# Altium project 2_Smoke_detector.PrjPcb (part 3 of 6)
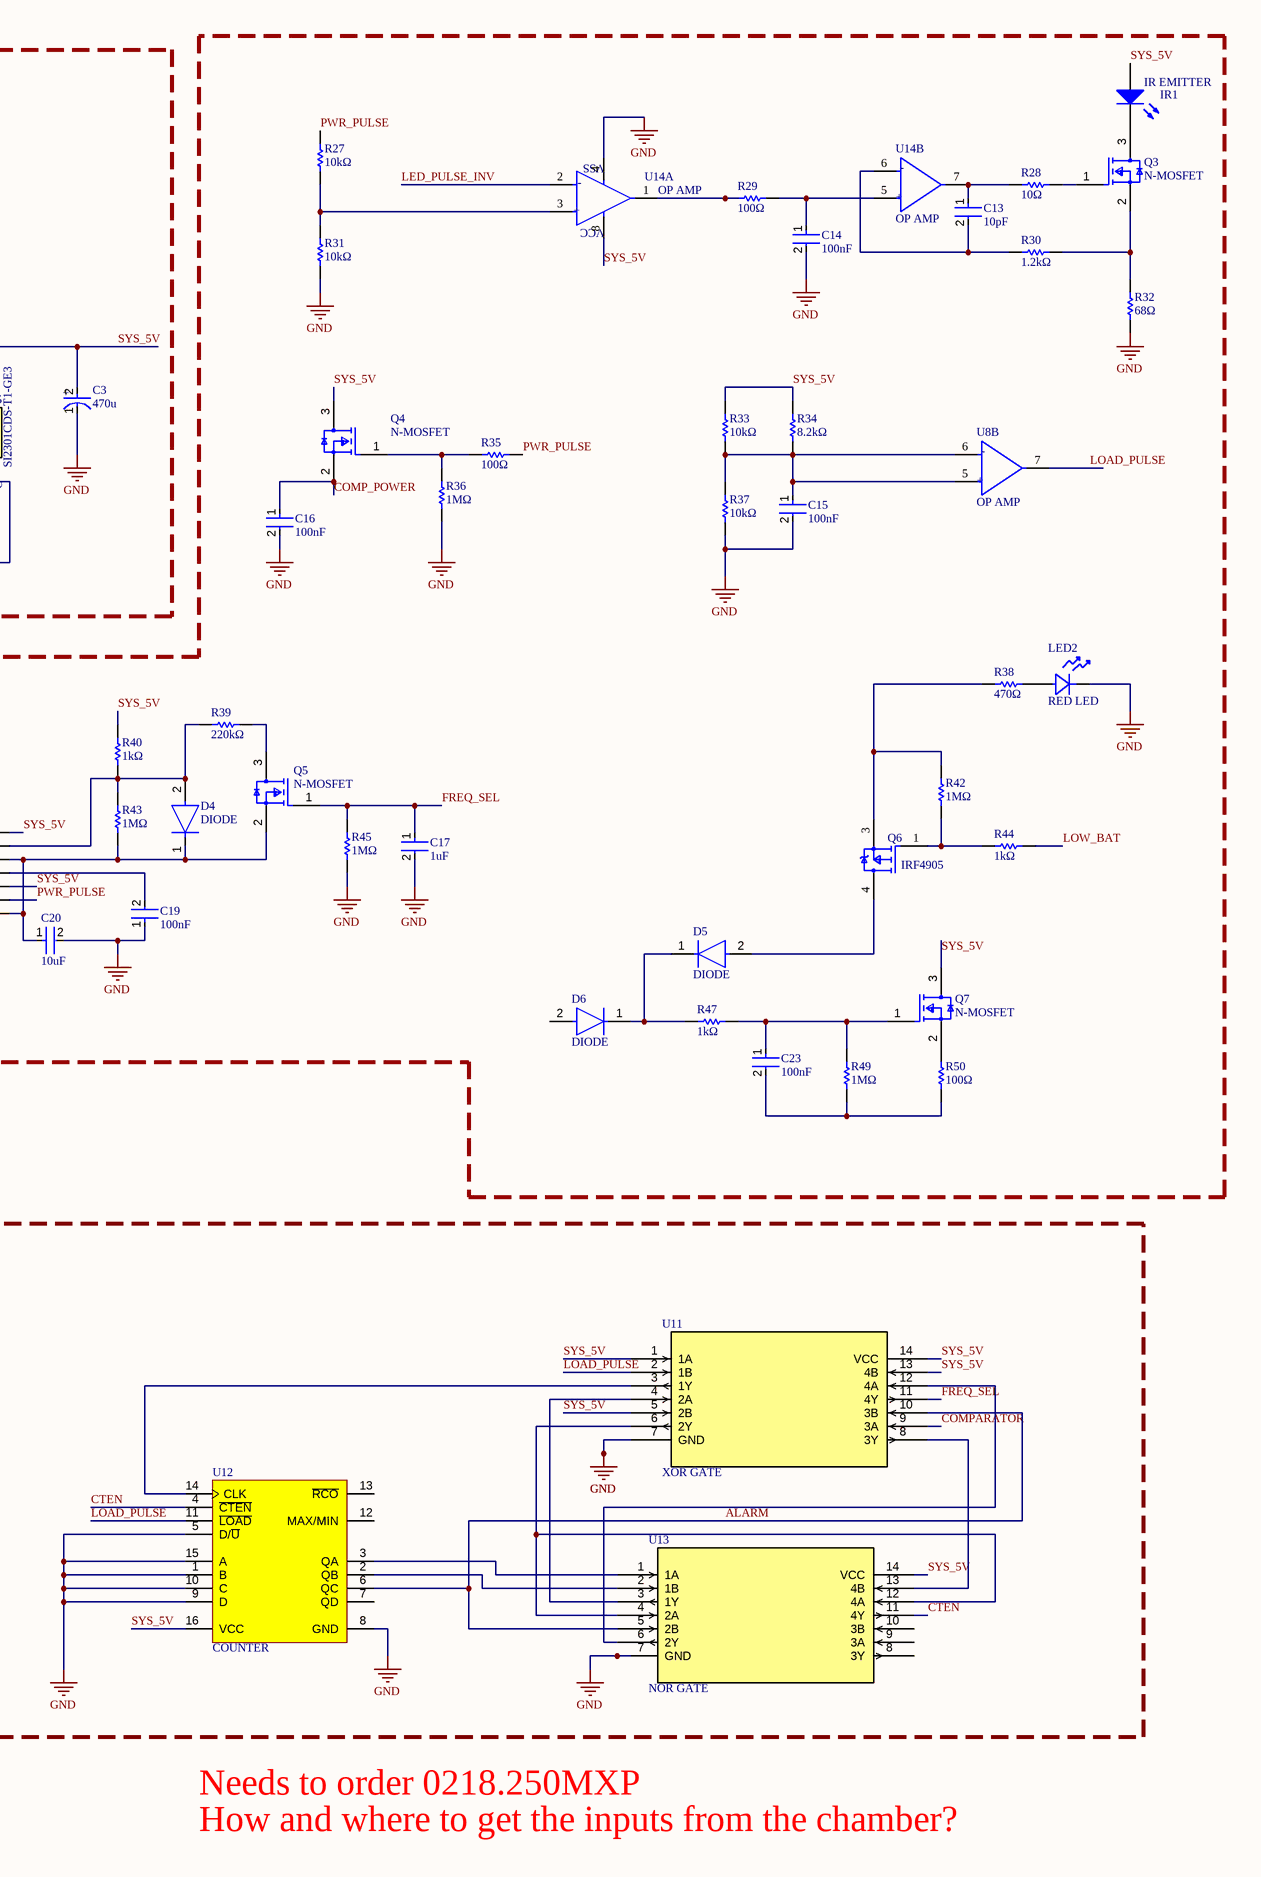
[diagram p3: 2_Smoke_detector.SchDoc, right]

## Sheet 2_Smoke_detector.SchDoc (continued)

### Library data of the parts (continued)
C17 = CL21B105KBFNNNE: CAP CER 1uF 50V X7R 0805; Manufacturer: Samsung Electro-Mechanics; Value: 1µF; Dielectric Material: Ceramic; Tolerance: 10%; Supplier: Avnet; Supplier Part Number: CL21B105KBFNNNE; Manufacturer Part Number: CL21B105KBFNNNE; RoHS: Compliant; Category: Ceramic Capacitors; Pricing: 2000=0.01628 (USD); Case/Package: 0805; Case Code (Imperial): 0805; Case Code (Metric): 2012; China RoHS: Compliant; Country of Origin: Mainland China, Philippines, South Korea; Depth: 1.25mm; Dielectric: X7R; Export Control Classification Number (ECCN) Code: EAR99; Height: 1.35mm; Harmonized Tariff Schedule (HTS) Code: 8532.24.00.20; Introduction Date: 2010-07-30; Length: 2mm; Lifecycle Status: Production; Material: Ceramic; Max Operating Temperature: 125°C; Min Operating Temperature: -55°C; Mounting Technology: Surface Mount; Number of Terminals: 2; Radiation Hardening: No; REACH SVHC: Unaffected; Schedule B: 8532240020, 8532240020|8532240020, 8532240020|8532240020|8532240020, 8532240020|8532240020|8532240020|8532240020; Thickness: 1.3462mm; Voltage: 50V; Voltage Rating: 50V; Voltage Rating (DC): 50V; Width: 1.25mm; ComponentLink1URL: https://datasheet.octopart.com:443/CL21B105KBFNNNE-Samsung-Electro-Mechanics-datasheet-136482495.pdf?src-supplier=IHS; ComponentLink1Description: https://datasheet.octopart.com:443/CL21B105KBFNNNE-Samsung-Electro-Mechanics-datasheet-136482495.pdf?src-supplier=IHS; ComponentLink2URL: https://datasheet.octopart.com:443/CL21B105KBFNNNE-Samsung-Electro-Mechanics-datasheet-11733377.pdf?src-supplier=Future+Electronics; ComponentLink2Description: https://datasheet.octopart.com:443/CL21B105KBFNNNE-Samsung-Electro-Mechanics-datasheet-11733377.pdf?src-supplier=Future+Electronics; ComponentLink3URL: https://datasheet.octopart.com:443/CL21B105KBFNNNE-Samsung-Electro-Mechanics-datasheet-116891038.pdf?src-supplier=Future+Electronics; ComponentLink3Description: https://datasheet.octopart.com:443/CL21B105KBFNNNE-Samsung-Electro-Mechanics-datasheet-116891038.pdf?src-supplier=Future+Electronics; ComponentLink4URL: https://datasheet.octopart.com:443/CL21B105KBFNNNE-Samsung-Electro-Mechanics-datasheet-81462183.pdf?src-supplier=Future+Electronics; ComponentLink4Description: https://datasheet.octopart.com:443/CL21B105KBFNNNE-Samsung-Electro-Mechanics-datasheet-81462183.pdf?src-supplier=Future+Electronics; ComponentLink5URL: https://datasheet.octopart.com:443/CL21B105KBFNNNE-Samsung-datasheet-48647582.pdf?src-supplier=Future+Electronics; ComponentLink5Description: https://datasheet.octopart.com:443/CL21B105KBFNNNE-Samsung-datasheet-48647582.pdf?src-supplier=Future+Electronics; ComponentLink6URL: https://datasheet.octopart.com:443/CL21B105KBFNNNE-Samsung-datasheet-8326294.pdf?src-supplier=Future+Electronics; ComponentLink6Description: https://datasheet.octopart.com:443/CL21B105KBFNNNE-Samsung-datasheet-8326294.pdf?src-supplier=Future+Electronics; ComponentLink7URL: https://datasheet.octopart.com:443/CL21B105KBFNNNE-Samsung-Electro-Mechanics-datasheet-149045959.pdf?src-supplier=Future+Electronics; ComponentLink7Description: https://datasheet.octopart.com:443/CL21B105KBFNNNE-Samsung-Electro-Mechanics-datasheet-149045959.pdf?src-supplier=Future+Electronics; ComponentLink8URL: https://datasheet.octopart.com/CL21B105KBFNNNE-Samsung-Electro-Mechanics-datasheet-97040617.pdf; ComponentLink8Description: https://datasheet.octopart.com/CL21B105KBFNNNE-Samsung-Electro-Mechanics-datasheet-97040617.pdf; ComponentLink9URL: https://datasheet.octopart.com/CL21B105KBFNNNE-Samsung-Electro-Mechanics-datasheet-8324245.pdf; ComponentLink9Description: https://datasheet.octopart.com/CL21B105KBFNNNE-Samsung-Electro-Mechanics-datasheet-8324245.pdf; ComponentLink10URL: https://datasheet.octopart.com/General-Multilayer-Ceramic-Capacitors-Samsung-datasheet-family-111.pdf; ComponentLink10Description: https://datasheet.octopart.com/General-Multilayer-Ceramic-Capacitors-Samsung-datasheet-family-111.pdf; ComponentLink11URL: https://datasheet.octopart.com:443/CL21B105KBFNNNE-Samsung-datasheet-59220082.pdf?src-supplier=TME; ComponentLink11Description: https://datasheet.octopart.com:443/CL21B105KBFNNNE-Samsung-datasheet-59220082.pdf?src-supplier=TME; ComponentLink12URL: http://sigma.octopart.com:80/rohs_certificate/General-Multilayer-Ceramic-Capacitors-Samsung-family-110.pdf?src-supplier=Compliance+Statements; ComponentLink12Description: http://sigma.octopart.com:80/rohs_certificate/General-Multilayer-Ceramic-Capacitors-Samsung-family-110.pdf?src-supplier=Compliance+Statements; ComponentLink13URL: http://sigma.octopart.com:80/rohs_statement/General-Multilayer-Ceramic-Capacitors-Samsung-family-132.pdf?src-supplier=Compliance+Statements; ComponentLink13Description: http://sigma.octopart.com:80/rohs_statement/General-Multilayer-Ceramic-Capacitors-Samsung-family-132.pdf?src-supplier=Compliance+Statements; ComponentLink14URL: http://sigma.octopart.com:80/reach_statement/General-Multilayer-Ceramic-Capacitors-Samsung-family-133.pdf?src-supplier=Compliance+Statements; ComponentLink14Description: http://sigma.octopart.com:80/reach_statement/General-Multilayer-Ceramic-Capacitors-Samsung-family-133.pdf?src-supplier=Compliance+Statements; LCSC Part Number: C28323
C20 = TMK212BBJ106KG-T: CAP CER 10uF 25V X5R 0805; Manufacturer: TAIYO YUDEN; Manufacturer Package Identifier: 0805 (2012 metric); Value: 10µF; Dielectric Material: Ceramic; Tolerance: 10%; Voltage: 16V; Supplier: Future Electronics; Supplier Part Number: TMK212BBJ106KG-T; Manufacturer Part Number: TMK212BBJ106KG-T; RoHS: Compliant; Category: Ceramic Capacitors; Stock: 405000; Pricing: 3000=0.158, 6000=0.156, 9000=0.154, 12000=0.153 (USD); Case/Package: 0805; Case Code (Imperial): 0805; Case Code (Metric): 2012; Composition: Ceramic; Country of Origin: Japan, Mainland China, Malaysia, South Korea; Dielectric: X5R; Export Control Classification Number (ECCN) Code: EAR99; Height: 1.25mm; Harmonized Tariff Schedule (HTS) Code: 8532.24.00.20; Introduction Date: 2012-09-27; Lead Free: Lead Free; Length: 2mm; Lifecycle Status: Production; Material: Ceramic; Max Operating Temperature: 85°C; Min Operating Temperature: -55°C; Mounting Technology: Surface Mount; Pins: 2; Number of Terminals: 2; REACH SVHC: Unaffected; Termination: SMD/SMT; Thickness: 1.3462mm; Voltage Rating: 25V; Voltage Rating (DC): 25V; Width: 1.25mm; ComponentLink1URL: https://datasheet.octopart.com:443/TMK212BBJ106KG-T-Taiyo-Yuden-datasheet-182120866.pdf?src-supplier=IHS; ComponentLink1Description: https://datasheet.octopart.com:443/TMK212BBJ106KG-T-Taiyo-Yuden-datasheet-182120866.pdf?src-supplier=IHS; ComponentLink2URL: https://datasheet.octopart.com:443/TMK212BBJ106KG-T-Taiyo-Yuden-datasheet-181961944.pdf?src-supplier=Newark; ComponentLink2Description: https://datasheet.octopart.com:443/TMK212BBJ106KG-T-Taiyo-Yuden-datasheet-181961944.pdf?src-supplier=Newark; ComponentLink3URL: https://datasheet.octopart.com:443/TMK212BBJ106KG-T-Taiyo-Yuden-datasheet-23715841.pdf?src-supplier=Newark; ComponentLink3Description: https://datasheet.octopart.com:443/TMK212BBJ106KG-T-Taiyo-Yuden-datasheet-23715841.pdf?src-supplier=Newark; ComponentLink4URL: https://datasheet.octopart.com:443/TMK212BBJ106KG-T-Taiyo-Yuden-datasheet-10851928.pdf?src-supplier=element14+APAC; ComponentLink4Description: https://datasheet.octopart.com:443/TMK212BBJ106KG-T-Taiyo-Yuden-datasheet-10851928.pdf?src-supplier=element14+APAC; ComponentLink5URL: https://datasheet.octopart.com:443/TMK212BBJ106KG-T-Taiyo-Yuden-datasheet-154810078.pdf?src-supplier=Master+Electronics; ComponentLink5Description: https://datasheet.octopart.com:443/TMK212BBJ106KG-T-Taiyo-Yuden-datasheet-154810078.pdf?src-supplier=Master+Electronics; ComponentLink6URL: https://datasheet.octopart.com:443/TMK212BBJ106KG-T-Taiyo-Yuden-datasheet-10742123.pdf?src-supplier=Future+Electronics; ComponentLink6Description: https://datasheet.octopart.com:443/TMK212BBJ106KG-T-Taiyo-Yuden-datasheet-10742123.pdf?src-supplier=Future+Electronics; ComponentLink7URL: https://datasheet.octopart.com:443/TMK212BBJ106KG-T-Taiyo-Yuden-datasheet-99833418.pdf?src-supplier=Future+Electronics; ComponentLink7Description: https://datasheet.octopart.com:443/TMK212BBJ106KG-T-Taiyo-Yuden-datasheet-99833418.pdf?src-supplier=Future+Electronics; ComponentLink8URL: https://datasheet.octopart.com:443/TMK212BBJ106KG-T-Taiyo-Yuden-datasheet-138738940.pdf?src-supplier=Taiyo+Yuden+SCT; ComponentLink8Description: https://datasheet.octopart.com:443/TMK212BBJ106KG-T-Taiyo-Yuden-datasheet-138738940.pdf?src-supplier=Taiyo+Yuden+SCT; ComponentLink9URL: https://datasheet.octopart.com:443/TMK212BBJ106KG-T-Taiyo-Yuden-datasheet-27089299.pdf?src-supplier=Electro+Sonic; ComponentLink9Description: https://datasheet.octopart.com:443/TMK212BBJ106KG-T-Taiyo-Yuden-datasheet-27089299.pdf?src-supplier=Electro+Sonic
D1 = BZX84-C3V3,215: DIODE ZENER 3.3V 250MW TO236AB; Manufacturer: Nexperia; Manufacturer Lifecycle Status: RELEASED FOR SUPPLY; Element Configuration: Single; ESD Protection: No; Forward Current: 200mA; Forward Voltage: 900mV; Impedance: 95Ω; Max Junction Temperature (Tj): 150°C; Max Reverse Leakage Current: 5µA; Number of Elements: 1; Polarity: Unidirectional; Reverse Standoff Voltage: 1V; Test Current: 5mA; Tolerance: 5%; Supplier: Future Electronics; Supplier Part Number: BZX84-C3V3,215; Manufacturer Part Number: BZX84-C3V3,215; RoHS: Compliant; Category: Zener Diodes; Stock: 108000; Pricing: 3000=0.0267, 9000=0.0261, 30000=0.0254, 60000=0.025, 120000=0.0243 (USD); Ambient Temperature Range High: 150°C; Case/Package: SOT-23; China RoHS: Compliant; Composition: Zener; Contact Plating: Tin; Country of Origin: Mainland China; Export Control Classification Number (ECCN) Code: EAR99; Height: 1.1mm; Harmonized Tariff Schedule (HTS) Code: 8541.10.00.50; Introduction Date: 1999-05-18; Lead Free: Lead Free; Length: 3mm; Lifecycle Status: Production; Max Operating Temperature: 150°C; Max Power Dissipation: 250mW; Min Operating Temperature: -65°C; Mounting Technology: Surface Mount; Pins: 3; Number of Terminals: 3; Peak Reverse Current: 5µA; Power Dissipation: 250mW; Radiation Hardening: No; REACH SVHC: Unaffected; Reference Voltage: 3.3V; Reverse Voltage: 1V; Schedule B: 8541100050, 8541100050|8541100050|8541100050|8541100050|8541100050|8541100050|8541100050|8541100050|8541100050|8541100050|8541100050|8541100050|8541100050|8541100050|8541100050|8541100050|8541100050|8541100050|8541100050|8541100050|8541100050|8541100050|8541100050|85; Voltage Tolerance: 5%; Weight: 4.535924g; Width: 1.4mm; Working Voltage: 3.3V; Zener Current: 5mA; Zener Voltage: 3.3V; ComponentLink1URL: https://datasheet.octopart.com:443/BZX84-C3V3%2C215-Nexperia-datasheet-180923215.pdf?src-supplier=IHS; ComponentLink1Description: https://datasheet.octopart.com:443/BZX84-C3V3%2C215-Nexperia-datasheet-180923215.pdf?src-supplier=IHS; ComponentLink2URL: https://datasheet.octopart.com:443/BZX84-C3V3%2C215-Nexperia-datasheet-24570111.pdf?src-supplier=IHS; ComponentLink2Description: https://datasheet.octopart.com:443/BZX84-C3V3%2C215-Nexperia-datasheet-24570111.pdf?src-supplier=IHS; ComponentLink3URL: https://datasheet.octopart.com:443/BZX84-C3V3%2C215-Nexperia-datasheet-81885907.pdf?src-supplier=Newark; ComponentLink3Description: https://datasheet.octopart.com:443/BZX84-C3V3%2C215-Nexperia-datasheet-81885907.pdf?src-supplier=Newark; ComponentLink4URL: https://sigma.octopart.com:443/138797052/technical_drawing/Nexperia-BZX84-C3V3%2C215.pdf?src-supplier=Upverter; ComponentLink4Description: https://sigma.octopart.com:443/138797052/technical_drawing/Nexperia-BZX84-C3V3%2C215.pdf?src-supplier=Upverter; ComponentLink5URL: https://datasheet.octopart.com:443/BZX84-C3V3%2C215-NXP-Semiconductors-datasheet-8361847.pdf?src-supplier=TME; ComponentLink5Description: https://datasheet.octopart.com:443/BZX84-C3V3%2C215-NXP-Semiconductors-datasheet-8361847.pdf?src-supplier=TME; ComponentLink6URL: https://datasheet.octopart.com:443/BZX84-C3V3%2C215-Nexperia-datasheet-14490340.pdf?src-supplier=element14+APAC; ComponentLink6Description: https://datasheet.octopart.com:443/BZX84-C3V3%2C215-Nexperia-datasheet-14490340.pdf?src-supplier=element14+APAC; ComponentLink7URL: https://datasheet.octopart.com:443/BZX84-C3V3%2C215-Nexperia-datasheet-116120567.pdf?src-supplier=Farnell; ComponentLink7Description: https://datasheet.octopart.com:443/BZX84-C3V3%2C215-Nexperia-datasheet-116120567.pdf?src-supplier=Farnell; ComponentLink8URL: https://datasheet.octopart.com:443/BZX84-C3V3%2C215-Nexperia-datasheet-164870381.pdf?src-supplier=Burklin+Elektronik; ComponentLink8Description: https://datasheet.octopart.com:443/BZX84-C3V3%2C215-Nexperia-datasheet-164870381.pdf?src-supplier=Burklin+Elektronik; ComponentLink9URL: https://datasheet.octopart.com:443/BZX84-C3V3%2C215-NXP-Semiconductors-datasheet-7823842.pdf?src-supplier=Jameco+(USA); ComponentLink9Description: https://datasheet.octopart.com:443/BZX84-C3V3%2C215-NXP-Semiconductors-datasheet-7823842.pdf?src-supplier=Jameco+(USA); ComponentLink10URL: https://datasheet.octopart.com:443/BZX84-C3V3%2C215-NXP-datasheet-30538.pdf?src-supplier=Future+Electronics; ComponentLink10Description: https://datasheet.octopart.com:443/BZX84-C3V3%2C215-NXP-datasheet-30538.pdf?src-supplier=Future+Electronics; ComponentLink11URL: http://sigma.octopart.com:80/reach_statement/NXP-Semiconductors-company-13.pdf?src-supplier=Compliance+Statements; ComponentLink11Description: http://sigma.octopart.com:80/reach_statement/NXP-Semiconductors-company-13.pdf?src-supplier=Compliance+Statements; ComponentLink12URL: http://sigma.octopart.com:80/rohs_statement/NXP-Semiconductors-company-12.pdf?src-supplier=Compliance+Statements; ComponentLink12Description: http://sigma.octopart.com:80/rohs_statement/NXP-Semiconductors-company-12.pdf?src-supplier=Compliance+Statements; LCSC Part Number: C85087
D2-D6 = 1N4148WS-E3-08: DIODE STANDARD 75V 150MA SOD323F; Manufacturer: onsemi; Manufacturer Lifecycle Status: ACTIVE; Value: 4pF; Element Configuration: Single; Forward Voltage: 1V; Max Forward Surge Current (Ifsm): 4A; Max Junction Temperature (Tj): 150°C; Max Power Dissipation: 200mW; Number of Elements: 1; Peak Reverse Current: 5µA; Recovery Time: 4ns; Supplier: Future Electronics; Supplier Part Number: 1N4148WS; Manufacturer Part Number: 1N4148WS; RoHS: Compliant; Category: Rectifier Diodes; Stock: 2079000; Pricing: 3000=0.0259, 9000=0.0253, 30000=0.0247, 60000=0.0243, 120000=0.0236 (USD); Average Rectified Current: 150mA; China RoHS: Compliant; Contact Plating: Tin; Export Control Classification Number (ECCN) Code: EAR99; Forward Current: 150mA; Height: 900µm; Harmonized Tariff Schedule (HTS) Code: 8541.10.00.70; Introduction Date: 2008-03-28; Lead Free: Lead Free; Length: 1.8mm; Lifecycle Status: Production; Max Operating Temperature: 150°C; Max Output current: 150mA; Max Repetitive Reverse Voltage (Vrrm): 75V; Max Reverse Voltage (DC): 75V; Min Breakdown Voltage: 75V; Min Operating Temperature: -55°C; Mounting Technology: Surface Mount; Pins: 2; Number of Terminals: 2; Packaging: Cut Tape; Power Dissipation: 200mW; Radiation Hardening: No; REACH SVHC: Unaffected; Reverse Recovery Time: 4ns; Reverse Standoff Voltage: 75V; Reverse Voltage: 75V; Schedule B: 8541100070, 8541100070|8541100070|8541100070|8541100070|8541100070|8541100070|8541100070|8541100070|8541100070|8541100070|8541100070|8541100070|8541100070|8541100070|8541100070|8541100070|8541100070|8541100070|8541100070|8541100070|8541100070|8541100070|8541100070|85; Weight: 27.6mg; Width: 1.35mm; ComponentLink1URL: https://datasheet.octopart.com:443/1N4148WS-ON-Semiconductor-datasheet-154551630.pdf?src-supplier=Farnell; ComponentLink1Description: https://datasheet.octopart.com:443/1N4148WS-ON-Semiconductor-datasheet-154551630.pdf?src-supplier=Farnell; ComponentLink2URL: https://datasheet.octopart.com:443/1N4148WS-Fairchild-Semiconductor-datasheet-67878664.pdf?src-supplier=Farnell; ComponentLink2Description: https://datasheet.octopart.com:443/1N4148WS-Fairchild-Semiconductor-datasheet-67878664.pdf?src-supplier=Farnell; ComponentLink3URL: https://datasheet.octopart.com:443/1N4148WS-Fairchild-Semiconductor-datasheet-68650011.pdf?src-supplier=Farnell; ComponentLink3Description: https://datasheet.octopart.com:443/1N4148WS-Fairchild-Semiconductor-datasheet-68650011.pdf?src-supplier=Farnell; ComponentLink4URL: https://datasheet.octopart.com:443/1N4148WS-ON-Semiconductor-datasheet-11741836.pdf?src-supplier=Upverter; ComponentLink4Description: https://datasheet.octopart.com:443/1N4148WS-ON-Semiconductor-datasheet-11741836.pdf?src-supplier=Upverter; ComponentLink5URL: https://datasheet.octopart.com:443/1N4148WS-ON-Semiconductor-datasheet-137236190.pdf?src-supplier=Upverter; ComponentLink5Description: https://datasheet.octopart.com:443/1N4148WS-ON-Semiconductor-datasheet-137236190.pdf?src-supplier=Upverter; ComponentLink6URL: https://sigma.octopart.com:443/138895951/technical_drawing/ON-Semiconductor-1N4148WS.pdf?src-supplier=Upverter; ComponentLink6Description: https://sigma.octopart.com:443/138895951/technical_drawing/ON-Semiconductor-1N4148WS.pdf?src-supplier=Upverter; ComponentLink7URL: https://datasheet.octopart.com:443/1N4148WS-ON-Semiconductor-datasheet-41168538.pdf?src-supplier=IHS; ComponentLink7Description: https://datasheet.octopart.com:443/1N4148WS-ON-Semiconductor-datasheet-41168538.pdf?src-supplier=IHS; ComponentLink8URL: https://datasheet.octopart.com:443/1N4148WS-onsemi-datasheet-175423434.pdf?src-supplier=IHS; ComponentLink8Description: https://datasheet.octopart.com:443/1N4148WS-onsemi-datasheet-175423434.pdf?src-supplier=IHS; ComponentLink9URL: https://datasheet.octopart.com:443/1N4148WS-onsemi-datasheet-181265883.pdf?src-supplier=IHS; ComponentLink9Description: https://datasheet.octopart.com:443/1N4148WS-onsemi-datasheet-181265883.pdf?src-supplier=IHS; ComponentLink10URL: https://datasheet.octopart.com:443/1N4148WS-ON-Semiconductor-datasheet-85393213.pdf?src-supplier=onsemi; ComponentLink10Description: https://datasheet.octopart.com:443/1N4148WS-ON-Semiconductor-datasheet-85393213.pdf?src-supplier=onsemi; ComponentLink11URL: https://datasheet.octopart.com:443/1N4148WS-ON-Semiconductor-datasheet-86684483.pdf?src-supplier=onsemi; ComponentLink11Description: https://datasheet.octopart.com:443/1N4148WS-ON-Semiconductor-datasheet-86684483.pdf?src-supplier=onsemi; ComponentLink12URL: https://datasheet.octopart.com:443/1N4148WS-ON-Semiconductor-datasheet-86681927.pdf?src-supplier=element14+APAC; ComponentLink12Description: https://datasheet.octopart.com:443/1N4148WS-ON-Semiconductor-datasheet-86681927.pdf?src-supplier=element14+APAC; ComponentLink13URL: https://datasheet.octopart.com:443/1N4148WS-Fairchild-datasheet-514620.pdf?src-supplier=Fairchild+Semiconductor; ComponentLink13Description: https://datasheet.octopart.com:443/1N4148WS-Fairchild-datasheet-514620.pdf?src-supplier=Fairchild+Semiconductor; ComponentLink14URL: https://sigma.octopart.com:443/17343424/technical_drawing/Fairchild-Semiconductor-1N4148WS.pdf?src-supplier=Fairchild+Semiconductor; ComponentLink14Description: https://sigma.octopart.com:443/17343424/technical_drawing/Fairchild-Semiconductor-1N4148WS.pdf?src-supplier=Fairchild+Semiconductor; ComponentLink15URL: https://datasheet.octopart.com:443/1N4148WS-Fairchild-Semiconductor-datasheet-14041777.pdf?src-supplier=iiiC; ComponentLink15Description: https://datasheet.octopart.com:443/1N4148WS-Fairchild-Semiconductor-datasheet-14041777.pdf?src-supplier=iiiC; ComponentLink16URL: https://datasheet.octopart.com:443/1N4148WS-Fairchild-Semiconductor-datasheet-67909704.pdf?src-supplier=Newark; ComponentLink16Description: https://datasheet.octopart.com:443/1N4148WS-Fairchild-Semiconductor-datasheet-67909704.pdf?src-supplier=Newark; ComponentLink17URL: https://datasheet.octopart.com:443/1N4148WS-Fairchild-Semiconductor-datasheet-68364970.pdf?src-supplier=Newark; ComponentLink17Description: https://datasheet.octopart.com:443/1N4148WS-Fairchild-Semiconductor-datasheet-68364970.pdf?src-supplier=Newark; ComponentLink18URL: http://sigma.octopart.com:80/150599222/rohs_statement/ON-Semiconductor-1N4148WS.pdf?src-supplier=Compliance+Statements; ComponentLink18Description: http://sigma.octopart.com:80/150599222/rohs_statement/ON-Semiconductor-1N4148WS.pdf?src-supplier=Compliance+Statements; ComponentLink19URL: http://sigma.octopart.com:80/17343422/reach_statement/Fairchild-Semiconductor-1N4148WS.pdf?src-supplier=Compliance+Statements; ComponentLink19Description: http://sigma.octopart.com:80/17343422/reach_statement/Fairchild-Semiconductor-1N4148WS.pdf?src-supplier=Compliance+Statements; ComponentLink20URL: http://sigma.octopart.com:80/17343423/materials_sheet/Fairchild-Semiconductor-1N4148WS.pdf?src-supplier=Compliance+Statements; ComponentLink20Description: http://sigma.octopart.com:80/17343423/materials_sheet/Fairchild-Semiconductor-1N4148WS.pdf?src-supplier=Compliance+Statements; ComponentLink21URL: http://sigma.octopart.com:80/33026183/reach_statement/Fairchild-Semiconductor-1N4148WS.pdf?src-supplier=Compliance+Statements; ComponentLink21Description: http://sigma.octopart.com:80/33026183/reach_statement/Fairchild-Semiconductor-1N4148WS.pdf?src-supplier=Compliance+Statements; ComponentLink22URL: http://sigma.octopart.com:80/33026185/materials_sheet/Fairchild-Semiconductor-1N4148WS.pdf?src-supplier=Compliance+Statements; ComponentLink22Description: http://sigma.octopart.com:80/33026185/materials_sheet/Fairchild-Semiconductor-1N4148WS.pdf?src-supplier=Compliance+Statements; ComponentLink23URL: http://sigma.octopart.com:80/reach_statement/ON-Semiconductor-company-79.pdf?src-supplier=Compliance+Statements; ComponentLink23Description: http://sigma.octopart.com:80/reach_statement/ON-Semiconductor-company-79.pdf?src-supplier=Compliance+Statements; ComponentLink24URL: http://sigma.octopart.com:80/rohs_statement/Fairchild-Semiconductor-company-11.pdf?src-supplier=Compliance+Statements; ComponentLink24Description: http://sigma.octopart.com:80/rohs_statement/Fairchild-Semiconductor-company-11.pdf?src-supplier=Compliance+Statements; ComponentLink25URL: http://sigma.octopart.com:80/rohs_statement/Fairchild-Semiconductor-company-10.pdf?src-supplier=Compliance+Statements; ComponentLink25Description: http://sigma.octopart.com:80/rohs_statement/Fairchild-Semiconductor-company-10.pdf?src-supplier=Compliance+Statements; ComponentLink26URL: http://sigma.octopart.com:80/reach_statement/Fairchild-Semiconductor-company-9.pdf?src-supplier=Compliance+Statements; ComponentLink26Description: http://sigma.octopart.com:80/reach_statement/Fairchild-Semiconductor-company-9.pdf?src-supplier=Compliance+Statements; ComponentLink27URL: https://octopart.com:443/opatz8j6/c1?t=wYHt1dYoStjiSyYS9vW1pk8TBFbYWJPKFwAairMtkTI2IzetMnotf66dDCFSyjK73l_QBYJfu5ppQQm6vgf_VHJk0XjigTM6-T2M3bc91CoF2qDUavTaGra1FaS73nSZTMHoTBKea7Kj1j1hvcXpUjB2Zk0lMEeZ2KChoJjU2Ep7qPghMWyiv02ETchNH2mt-frVeZibxDJuov5OgRy4oXlMX2fxSj9TvPDNPennBmBqeUUTYkCA50MC-HqnwAKd1gKHUqYazBTe_nq1LN0s0W5Jcc0mVIJ85rMEaCpPi0OTe20L35dkFVsyd7-f2a8RbDuWQx2ZnqCVBv226imj86RP5GabsSkQ-q8&src-supplier=Compliance+Statements; ComponentLink27Description: https://octopart.com:443/opatz8j6/c1?t=wYHt1dYoStjiSyYS9vW1pk8TBFbYWJPKFwAairMtkTI2IzetMnotf66dDCFSyjK73l_QBYJfu5ppQQm6vgf_VHJk0XjigTM6-T2M3bc91CoF2qDUavTaGra1FaS73nSZTMHoTBKea7Kj1j1hvcXpUjB2Zk0lMEeZ2KChoJjU2Ep7qPghMWyiv02ETchNH2mt-frVeZibxDJuov5OgRy4oXlMX2fxSj9TvPDNPennBmBqeUUTYkCA50MC-HqnwAKd1gKHUqYazBTe_nq1LN0s0W5Jcc0mVIJ85rMEaCpPi0OTe20L35dkFVsyd7-f2a8RbDuWQx2ZnqCVBv226imj86RP5GabsSkQ-q8&src-supplier=Compliance+Statements; ComponentLink28URL: https://octopart.com:443/opatz8j6/c1?t=6vrIx-b4A-5fTDbLjwi5zcgi6qXstL13SMOS8GjYhuBtwDmRjNAy9ckQ1j_vzrk3p8PqJRRo0Q4ZFDRtNoBSdN2VF6uD6HFnto0wbTQpFwKFVCYeCRTsvot6NzZ0_E0kU2SFINObuRWijlVlxtaCxHPxDSHGUbvJMCGqPlgW3d4BMWXN1gHWf3JhMnqeX7DV1-lrPzrjwC1tz_ReOkIeYv0g5upleZgG8h_6jp4K0TmHBgFsbpIaQ-XR6Em3Oa61Yv4vos_yXn82U0YoobWb_whq6HKgdR1UB_qD5SusD-cTSj2uztk2uKh_PoqkpyxAx9Tc5grDAFkfViYluG8WwhfepkjrF-7yDpGH&src-supplier=Compliance+Statements; ComponentLink28Description: https://octopart.com:443/opatz8j6/c1?t=6vrIx-b4A-5fTDbLjwi5zcgi6qXstL13SMOS8GjYhuBtwDmRjNAy9ckQ1j_vzrk3p8PqJRRo0Q4ZFDRtNoBSdN2VF6uD6HFnto0wbTQpFwKFVCYeCRTsvot6NzZ0_E0kU2SFINObuRWijlVlxtaCxHPxDSHGUbvJMCGqPlgW3d4BMWXN1gHWf3JhMnqeX7DV1-lrPzrjwC1tz_ReOkIeYv0g5upleZgG8h_6jp4K0TmHBgFsbpIaQ-XR6Em3Oa61Yv4vos_yXn82U0YoobWb_whq6HKgdR1UB_qD5SusD-cTSj2uztk2uKh_PoqkpyxAx9Tc5grDAFkfViYluG8WwhfepkjrF-7yDpGH&src-supplier=Compliance+Statements; LCSC Part Number: C129905
F1 = 4628: FUSE HLDR CARTRIDGE 250V 5A PCB; Manufacturer: Keystone; Approvals: UL; Body Material: Nylon; Color: Black; Illumination Type: Illuminated; Material: Brass, Nylon, Tin; Number of Circuits: 1; Supplier: Future Electronics; Supplier Part Number: 4628; Manufacturer Part Number: 4628; RoHS: Compliant; Category: Fuse Holders; Stock: 3395; Pricing: 30=0.62, 100=0.605, 300=0.59, 1000=0.575, 3000=0.55 (USD); Contact Material: Brass; Contact Plating: Tin; Country of Origin: Italy; Current Rating: 5A; Depth: 9mm; Fuse Current: 5A; Introduction Date: 2008-01-24; Lead Free: Lead Free; Length: 24.2mm; Lifecycle Status: Production; Max Operating Temperature: 145°C; Min Operating Temperature: -50°C; Mounting Technology: Horizontal, PCB; Number of Poles: 1; Orientation: Horizontal; REACH SVHC: Unaffected; Termination: PC Pin; Voltage: 250V; Voltage Rating: 250V; Voltage Rating (AC): 250V; Voltage Rating (DC): 250V; Width: 9.52mm; ComponentLink1URL: https://datasheet.octopart.com:443/4628-Keystone-datasheet-15715941.pdf?src-supplier=Future+Electronics; ComponentLink1Description: https://datasheet.octopart.com:443/4628-Keystone-datasheet-15715941.pdf?src-supplier=Future+Electronics; ComponentLink2URL: https://datasheet.octopart.com:443/4628-Keystone-datasheet-3558.pdf?src-supplier=Future+Electronics; ComponentLink2Description: https://datasheet.octopart.com:443/4628-Keystone-datasheet-3558.pdf?src-supplier=Future+Electronics; ComponentLink3URL: https://datasheet.octopart.com:443/4628-Keystone-datasheet-68300138.pdf?src-supplier=Future+Electronics; ComponentLink3Description: https://datasheet.octopart.com:443/4628-Keystone-datasheet-68300138.pdf?src-supplier=Future+Electronics; ComponentLink4URL: https://datasheet.octopart.com:443/4628-Keystone-datasheet-110727089.pdf?src-supplier=Future+Electronics; ComponentLink4Description: https://datasheet.octopart.com:443/4628-Keystone-datasheet-110727089.pdf?src-supplier=Future+Electronics; ComponentLink5URL: https://datasheet.octopart.com:443/4628-Keystone-datasheet-536768.pdf?src-supplier=Future+Electronics; ComponentLink5Description: https://datasheet.octopart.com:443/4628-Keystone-datasheet-536768.pdf?src-supplier=Future+Electronics; ComponentLink6URL: https://datasheet.octopart.com:443/4628-Keystone-datasheet-21202851.pdf?src-supplier=Farnell; ComponentLink6Description: https://datasheet.octopart.com:443/4628-Keystone-datasheet-21202851.pdf?src-supplier=Farnell; ComponentLink7URL: https://datasheet.octopart.com:443/4628-Keystone-datasheet-15983575.pdf?src-supplier=Sager+Electronics; ComponentLink7Description: https://datasheet.octopart.com:443/4628-Keystone-datasheet-15983575.pdf?src-supplier=Sager+Electronics; ComponentLink8URL: https://datasheet.octopart.com:443/4628-Keystone-datasheet-7830329.pdf?src-supplier=RS+(Formerly+Allied+Electronics); ComponentLink8Description: https://datasheet.octopart.com:443/4628-Keystone-datasheet-7830329.pdf?src-supplier=RS+(Formerly+Allied+Electronics); ComponentLink9URL: https://datasheet.octopart.com:443/4628-Keystone-datasheet-37511814.pdf?src-supplier=RS+(Formerly+Allied+Electronics); ComponentLink9Description: https://datasheet.octopart.com:443/4628-Keystone-datasheet-37511814.pdf?src-supplier=RS+(Formerly+Allied+Electronics); ComponentLink10URL: https://datasheet.octopart.com:443/4628-Keystone-datasheet-57465.pdf?src-supplier=RS+(Formerly+Allied+Electronics); ComponentLink10Description: https://datasheet.octopart.com:443/4628-Keystone-datasheet-57465.pdf?src-supplier=RS+(Formerly+Allied+Electronics); LCSC Part Number: C3205254
IR1 = TSAL6200: EMITTER IR 940NM 100MA RADIAL; Manufacturer: Vishay; Fall Time: 800ns; Forward Voltage: 1.35V; Lead Length: 25.7mm; Lens Style: Circular, Colored, Round; Max Power Dissipation: 160mW; Number of Circuits: 1; Operating Supply Voltage: 1.6V; Output Power: 35mW; Power Rating: 210mW; Reverse Voltage: 5V; Shape: Round; Viewing Angle: 17°; Supplier: Avnet; Supplier Part Number: TSAL6200; Manufacturer Part Number: TSAL6200; RoHS: Compliant; Category: LEDs; Stock: 5493; Pricing: 1=0.513, 10=0.361, 100=0.265, 500=0.222, 1000=0.208, 2500=0.202, 10000=0.176 (USD); Case/Package: Radial; Contact Plating: Tin; Country of Origin: Mainland China; Depth: 5.8mm; Forward Current: 100mA; Harmonized Tariff Schedule (HTS) Code: 8541.40.20.00; Introduction Date: 1998-02-03; Lead Free: Lead Free; Length: 5.8mm; Lifecycle Status: Production; Max Operating Temperature: 85°C; Min Operating Temperature: -55°C; Mounting Technology: Through Hole; Number of Elements: 1; Number of LEDs: 1; Pins: 2; Orientation: Top View; Packaging: Bulk; Peak Wavelength: 940nm; Radiation Hardening: No; REACH SVHC: Unaffected; Rise Time: 800ns; Schedule B: 8541402000, 8541402000|8541402000, 8541402000|8541402000|8541402000, 8541402000|8541402000|8541402000|8541402000; Test Current: 100mA; Voltage Rating (DC): 5V; Wavelength: 940nm; ComponentLink1URL: https://datasheet.octopart.com:443/TSAL6200-Vishay-datasheet-181476199.pdf?src-supplier=IHS; ComponentLink1Description: https://datasheet.octopart.com:443/TSAL6200-Vishay-datasheet-181476199.pdf?src-supplier=IHS; ComponentLink2URL: https://datasheet.octopart.com:443/TSAL6200-Vishay-datasheet-181483901.pdf?src-supplier=IHS; ComponentLink2Description: https://datasheet.octopart.com:443/TSAL6200-Vishay-datasheet-181483901.pdf?src-supplier=IHS; ComponentLink3URL: https://datasheet.octopart.com:443/TSAL6200-Vishay-datasheet-141913874.pdf?src-supplier=Upverter; ComponentLink3Description: https://datasheet.octopart.com:443/TSAL6200-Vishay-datasheet-141913874.pdf?src-supplier=Upverter; ComponentLink4URL: https://datasheet.octopart.com:443/TSAL6200-Vishay-datasheet-8558926.pdf?src-supplier=Newark; ComponentLink4Description: https://datasheet.octopart.com:443/TSAL6200-Vishay-datasheet-8558926.pdf?src-supplier=Newark; ComponentLink5URL: https://datasheet.octopart.com:443/TSAL6200-Vishay-datasheet-506685.pdf?src-supplier=Newark; ComponentLink5Description: https://datasheet.octopart.com:443/TSAL6200-Vishay-datasheet-506685.pdf?src-supplier=Newark; ComponentLink6URL: https://datasheet.octopart.com:443/TSAL6200-Vishay-datasheet-34170271.pdf?src-supplier=Newark; ComponentLink6Description: https://datasheet.octopart.com:443/TSAL6200-Vishay-datasheet-34170271.pdf?src-supplier=Newark; ComponentLink7URL: https://datasheet.octopart.com:443/TSAL6200-Vishay-Semiconductor-datasheet-33014447.pdf?src-supplier=Newark; ComponentLink7Description: https://datasheet.octopart.com:443/TSAL6200-Vishay-Semiconductor-datasheet-33014447.pdf?src-supplier=Newark; ComponentLink8URL: https://datasheet.octopart.com:443/TSAL6200...-Vishay-datasheet-78835386.pdf?src-supplier=element14+APAC; ComponentLink8Description: https://datasheet.octopart.com:443/TSAL6200...-Vishay-datasheet-78835386.pdf?src-supplier=element14+APAC; ComponentLink9URL: https://datasheet.octopart.com:443/TSAL6200-Vishay-datasheet-62319407.pdf?src-supplier=Farnell; ComponentLink9Description: https://datasheet.octopart.com:443/TSAL6200-Vishay-datasheet-62319407.pdf?src-supplier=Farnell; ComponentLink10URL: https://datasheet.octopart.com:443/TSAL6200-Vishay-datasheet-34180579.pdf?src-supplier=Farnell; ComponentLink10Description: https://datasheet.octopart.com:443/TSAL6200-Vishay-datasheet-34180579.pdf?src-supplier=Farnell; ComponentLink11URL: https://datasheet.octopart.com:443/TSAL6200.-Vishay-datasheet-508933.pdf?src-supplier=Farnell; ComponentLink11Description: https://datasheet.octopart.com:443/TSAL6200.-Vishay-datasheet-508933.pdf?src-supplier=Farnell; ComponentLink12URL: https://datasheet.octopart.com:443/TSAL6200-Vishay-datasheet-68150.pdf?src-supplier=TME; ComponentLink12Description: https://datasheet.octopart.com:443/TSAL6200-Vishay-datasheet-68150.pdf?src-supplier=TME; ComponentLink13URL: https://datasheet.octopart.com:443/TSAL6200-Vishay-datasheet-41222433.pdf?src-supplier=Seeed+Studio; ComponentLink13Description: https://datasheet.octopart.com:443/TSAL6200-Vishay-datasheet-41222433.pdf?src-supplier=Seeed+Studio; ComponentLink14URL: https://datasheet.octopart.com:443/TSAL6200-Vishay-datasheet-14190171.pdf?src-supplier=iiiC; ComponentLink14Description: https://datasheet.octopart.com:443/TSAL6200-Vishay-datasheet-14190171.pdf?src-supplier=iiiC; ComponentLink15URL: https://datasheet.octopart.com:443/TSAL6200-Vishay-datasheet-10862748.pdf?src-supplier=RS+(Formerly+Allied+Electronics); ComponentLink15Description: https://datasheet.octopart.com:443/TSAL6200-Vishay-datasheet-10862748.pdf?src-supplier=RS+(Formerly+Allied+Electronics); ComponentLink16URL: http://sigma.octopart.com:80/rohs_statement/Vishay-company-15.pdf?src-supplier=Compliance+Statements; ComponentLink16Description: http://sigma.octopart.com:80/rohs_statement/Vishay-company-15.pdf?src-supplier=Compliance+Statements; LCSC Part Number: C55528
J1 = 1715721: TERM BLK 2P SIDE ENT 5.08MM PCB; Manufacturer: Phoenix Contact; Manufacturer Lifecycle Status: AVAILABLE; Approvals: CSA, cUL; Connector Type: PCB, Screw, Terminal Block; Current: 15A; Current Rating: 17.5A; Max Current Rating: 22A; Max Supply Voltage: 250V; Number of Circuits: 2; Number of Levels: 1; Stripping Length: 7mm; Test Voltage: 4kV; Voltage: 300V; Voltage Rating: 400V; Wire/Cable Gauge: 14AWG; Wire Gauge (Max): 26AWG; Supplier: Arrow Electronics; Supplier Part Number: 1715721; Manufacturer Part Number: 1715721; RoHS: Compliant; Category: Terminal Blocks; Stock: 4066; Pricing: 1=1.109, 251=1.006 (USD); China RoHS: Compliant; Color: Green; Contact Material: Tin; Country of Origin: Germany; Depth: 9.8mm; Export Control Classification Number (ECCN) Code: EAR99; Flammability Rating: UL94 V-0; Height: 17.3mm; Housing Color: Green; Harmonized Tariff Schedule (HTS) Code: 8536.90.40.00; Insulation Material: Nylon; Introduction Date: 1998-01-15; Lead Free: Lead Free; Lead Pitch: 5.08mm; Length: 10.16mm; Lifecycle Status: Production; Max Operating Temperature: 100°C; Min Operating Temperature: -20°C; Mounting Technology: Screw; Number of Contacts: 2; Pins: 2; Number of Poles: 2; Number of Positions: 2; Number of Positions Per Level: 2; Number of Rows: 1; Orientation: Straight; Pitch: 5.08mm; Radiation Hardening: No; REACH SVHC: Unaffected; Termination: Screw; Voltage Rating (AC): 250V; Weight: 2.939987g; Width: 17.3mm; Wire Gauge (Min): 26AWG; ComponentLink1URL: https://datasheet.octopart.com:443/1715721-Phoenix-Contact-datasheet-195288929.pdf?src-supplier=Phoenix+Contact; ComponentLink1Description: https://datasheet.octopart.com:443/1715721-Phoenix-Contact-datasheet-195288929.pdf?src-supplier=Phoenix+Contact; ComponentLink2URL: https://sigma.octopart.com:443/195221700/technical_drawing/Phoenix-Contact-1715721.pdf?src-supplier=Phoenix+Contact; ComponentLink2Description: https://sigma.octopart.com:443/195221700/technical_drawing/Phoenix-Contact-1715721.pdf?src-supplier=Phoenix+Contact; ComponentLink3URL: https://datasheet.octopart.com:443/1715721-Phoenix-Contact-datasheet-62122377.pdf?src-supplier=Upverter; ComponentLink3Description: https://datasheet.octopart.com:443/1715721-Phoenix-Contact-datasheet-62122377.pdf?src-supplier=Upverter; ComponentLink4URL: https://datasheet.octopart.com:443/1715721-Phoenix-Contact-datasheet-181073212.pdf?src-supplier=IHS; ComponentLink4Description: https://datasheet.octopart.com:443/1715721-Phoenix-Contact-datasheet-181073212.pdf?src-supplier=IHS; ComponentLink5URL: https://datasheet.octopart.com:443/1715721-Phoenix-Contact-datasheet-66579234.pdf?src-supplier=Master+Electronics; ComponentLink5Description: https://datasheet.octopart.com:443/1715721-Phoenix-Contact-datasheet-66579234.pdf?src-supplier=Master+Electronics; ComponentLink6URL: https://datasheet.octopart.com:443/1715721-Phoenix-Contact-datasheet-14715205.pdf?src-supplier=Newark; ComponentLink6Description: https://datasheet.octopart.com:443/1715721-Phoenix-Contact-datasheet-14715205.pdf?src-supplier=Newark; ComponentLink7URL: https://datasheet.octopart.com:443/1715721-Phoenix-Contact-datasheet-499485.pdf?src-supplier=Newark; ComponentLink7Description: https://datasheet.octopart.com:443/1715721-Phoenix-Contact-datasheet-499485.pdf?src-supplier=Newark; ComponentLink8URL: https://datasheet.octopart.com:443/1715721-Phoenix-Contact-datasheet-154778360.pdf?src-supplier=Electro+Sonic; ComponentLink8Description: https://datasheet.octopart.com:443/1715721-Phoenix-Contact-datasheet-154778360.pdf?src-supplier=Electro+Sonic; ComponentLink9URL: https://datasheet.octopart.com:443/1715721-Phoenix-Contact-datasheet-9792235.pdf?src-supplier=TodayComponents; ComponentLink9Description: https://datasheet.octopart.com:443/1715721-Phoenix-Contact-datasheet-9792235.pdf?src-supplier=TodayComponents; ComponentLink10URL: https://datasheet.octopart.com:443/1715721-Phoenix-Contact-datasheet-166145896.pdf?src-supplier=Burklin+Elektronik; ComponentLink10Description: https://datasheet.octopart.com:443/1715721-Phoenix-Contact-datasheet-166145896.pdf?src-supplier=Burklin+Elektronik; ComponentLink11URL: https://datasheet.octopart.com:443/1715721-Phoenix-Contact-datasheet-33452854.pdf?src-supplier=MRO+Stop; ComponentLink11Description: https://datasheet.octopart.com:443/1715721-Phoenix-Contact-datasheet-33452854.pdf?src-supplier=MRO+Stop; ComponentLink12URL: https://datasheet.octopart.com:443/1715721-Phoenix-Contact-datasheet-8332660.pdf?src-supplier=Future+Electronics; ComponentLink12Description: https://datasheet.octopart.com:443/1715721-Phoenix-Contact-datasheet-8332660.pdf?src-supplier=Future+Electronics; ComponentLink13URL: https://datasheet.octopart.com:443/1715721-Phoenix-Contact-datasheet-19322.pdf?src-supplier=RS+(Formerly+Allied+Electronics); ComponentLink13Description: https://datasheet.octopart.com:443/1715721-Phoenix-Contact-datasheet-19322.pdf?src-supplier=RS+(Formerly+Allied+Electronics); ComponentLink14URL: https://datasheet.octopart.com:443/1715721-Phoenix-Contact-datasheet-84424.pdf?src-supplier=DigiKey; ComponentLink14Description: https://datasheet.octopart.com:443/1715721-Phoenix-Contact-datasheet-84424.pdf?src-supplier=DigiKey; ComponentLink15URL: http://sigma.octopart.com:80/195206437/materials_sheet/Phoenix-Contact-1715721.pdf?src-supplier=Compliance+Statements; ComponentLink15Description: http://sigma.octopart.com:80/195206437/materials_sheet/Phoenix-Contact-1715721.pdf?src-supplier=Compliance+Statements; LCSC Part Number: C480516
J2 = B2B-PH-K-S(LF)(SN): CONN HEADER VERT 2POS 2MM; Style/Orientation: StraightHeader/Plug; No of Positions: 2; Pitch: 2mm; Datasheet Version: Nov-08; Datasheet URL: http://datasheet.octopart.com/B2B-PH-K-S%28LF%29%28SN%29-JST-datasheet-8324864.pdf; Manufacturer URL: http://www.jst.com/home2.html; Type: ShroudedHeader; Termination: Crimp; Manufacturer: JST; LCSC Part Number: C131337
LED1 = XL-2012SURC_YELLOW: CHIP LED 0805 YELLOW SMD; Manufacturer_Name: XINGLIGHT; Copyright: Copyright (C) 2025 Ultra Librarian. All rights reserved.; Manufacturer_Part_Number: XL-2012SURC; LCSC Part Number: C965814
LED2 = XL-2012SURC_RED: CHIP LED 0805 RED SMD; Manufacturer_Name: XINGLIGHT; Copyright: Copyright (C) 2025 Ultra Librarian. All rights reserved.; Manufacturer_Part_Number: XL-2012SURC; LCSC Part Number: C965812
Q1 = BC847BW,115: TRANS NPN 45V 0.1A SOT-323; Manufacturer: Nexperia; Manufacturer Lifecycle Status: RELEASED FOR SUPPLY; Collector Base Voltage (VCBO): 50V; Collector Emitter Saturation Voltage: 400mV; Element Configuration: Single; Emitter Base Voltage (VEBO): 6V; Frequency: 100MHz; hFE Min: 200; Max Collector Current: 100mA; Max Junction Temperature (Tj): 150°C; Max Power Dissipation: 200mW; Number of Elements: 1; Supplier: Future Electronics; Supplier Part Number: BC847BW,115; Manufacturer Part Number: BC847BW,115; RoHS: Compliant; Category: BJTs; Stock: 927000; Pricing: 3000=0.0248, 9000=0.0242, 30000=0.0236, 60000=0.0233, 120000=0.0226 (USD); Ambient Temperature Range High: 150°C; Case/Package: SOT-323; China RoHS: Compliant; Collector Emitter Breakdown Voltage: 45V; Collector Emitter Voltage (VCEO): 45V; Contact Plating: Tin; Country of Origin: Mainland China, Malaysia; Export Control Classification Number (ECCN) Code: EAR99; Gain Bandwidth Product: 100MHz; Height: 1.1mm; Harmonized Tariff Schedule (HTS) Code: 8541.21.00.95; Introduction Date: 1997-09-01; Lead Free: Lead Free; Length: 2.2mm; Lifecycle Status: Production; Max Breakdown Voltage: 45V; Clock Frequency: 100MHz; Max Operating Temperature: 150°C; Min Operating Temperature: -65°C; Mounting Technology: Surface Mount; Pins: 3; Number of Terminals: 3; Packaging: Cut Tape; Polarity: NPN; Power Dissipation: 200mW; Radiation Hardening: No; REACH SVHC: Unaffected; Schedule B: 8541210080, 8541210080|8541210080|8541210080|8541210080|8541210080; Transition Frequency: 100MHz; Width: 1.35mm; ComponentLink1URL: https://datasheet.octopart.com:443/BC847BW%2C115-Nexperia-datasheet-180923431.pdf?src-supplier=IHS; ComponentLink1Description: https://datasheet.octopart.com:443/BC847BW%2C115-Nexperia-datasheet-180923431.pdf?src-supplier=IHS; ComponentLink2URL: https://datasheet.octopart.com:443/BC847BW%2C115-Nexperia-datasheet-103923196.pdf?src-supplier=Upverter; ComponentLink2Description: https://datasheet.octopart.com:443/BC847BW%2C115-Nexperia-datasheet-103923196.pdf?src-supplier=Upverter; ComponentLink3URL: https://sigma.octopart.com:443/138897295/technical_drawing/Nexperia-BC847BW%2C115.pdf?src-supplier=Upverter; ComponentLink3Description: https://sigma.octopart.com:443/138897295/technical_drawing/Nexperia-BC847BW%2C115.pdf?src-supplier=Upverter; ComponentLink4URL: https://datasheet.octopart.com:443/BC847BW%2C115-Nexperia-datasheet-160638900.pdf?src-supplier=Newark; ComponentLink4Description: https://datasheet.octopart.com:443/BC847BW%2C115-Nexperia-datasheet-160638900.pdf?src-supplier=Newark; ComponentLink5URL: https://datasheet.octopart.com:443/BC847BW%2C115-Nexperia-datasheet-33021882.pdf?src-supplier=Newark; ComponentLink5Description: https://datasheet.octopart.com:443/BC847BW%2C115-Nexperia-datasheet-33021882.pdf?src-supplier=Newark; ComponentLink6URL: https://datasheet.octopart.com:443/BC847BW%2C115-Nexperia-datasheet-11982477.pdf?src-supplier=Newark; ComponentLink6Description: https://datasheet.octopart.com:443/BC847BW%2C115-Nexperia-datasheet-11982477.pdf?src-supplier=Newark; ComponentLink7URL: https://datasheet.octopart.com:443/BC847BW%2C115-Nexperia-datasheet-164345414.pdf?src-supplier=Future+Electronics; ComponentLink7Description: https://datasheet.octopart.com:443/BC847BW%2C115-Nexperia-datasheet-164345414.pdf?src-supplier=Future+Electronics; ComponentLink8URL: https://datasheet.octopart.com:443/BC847BW%2C115-Nexperia-datasheet-87580896.pdf?src-supplier=Future+Electronics; ComponentLink8Description: https://datasheet.octopart.com:443/BC847BW%2C115-Nexperia-datasheet-87580896.pdf?src-supplier=Future+Electronics; ComponentLink9URL: https://datasheet.octopart.com:443/BC847BW%2C115-Nexperia-datasheet-81456218.pdf?src-supplier=Nexperia; ComponentLink9Description: https://datasheet.octopart.com:443/BC847BW%2C115-Nexperia-datasheet-81456218.pdf?src-supplier=Nexperia; ComponentLink10URL: https://datasheet.octopart.com:443/BC847BW%2C115-Nexperia-datasheet-5341283.pdf?src-supplier=_legacy+Avnet; ComponentLink10Description: https://datasheet.octopart.com:443/BC847BW%2C115-Nexperia-datasheet-5341283.pdf?src-supplier=_legacy+Avnet; ComponentLink11URL: https://datasheet.octopart.com:443/BC847BW%2C115-NXP-Semiconductors-datasheet-20734447.pdf?src-supplier=Farnell; ComponentLink11Description: https://datasheet.octopart.com:443/BC847BW%2C115-NXP-Semiconductors-datasheet-20734447.pdf?src-supplier=Farnell; ComponentLink12URL: http://sigma.octopart.com:80/reach_statement/NXP-Semiconductors-company-13.pdf?src-supplier=Compliance+Statements; ComponentLink12Description: http://sigma.octopart.com:80/reach_statement/NXP-Semiconductors-company-13.pdf?src-supplier=Compliance+Statements; ComponentLink13URL: http://sigma.octopart.com:80/rohs_statement/NXP-Semiconductors-company-12.pdf?src-supplier=Compliance+Statements; ComponentLink13Description: http://sigma.octopart.com:80/rohs_statement/NXP-Semiconductors-company-12.pdf?src-supplier=Compliance+Statements; LCSC Part Number: C8659
Q2-Q5 Q7 = AO3400A: MOSFET N-CH 30V 5.7A SOT23-3L; Manufacturer: Alpha & Omega Semiconductor; Drain to Source Resistance: 26.5mΩ; Gate to Source Voltage (Vgs): 12V; Input Capacitance: 630pF; Max Junction Temperature (Tj): 150°C; Max Power Dissipation: 1.4W; Number of Channels: 1; Threshold Voltage: 650mV; Turn-Off Delay Time: 25ns; Turn-On Delay Time: 3ns; Supplier: DigiKey; Supplier Part Number: 785-1000-6-ND; Manufacturer Part Number: AO3400A; RoHS: Compliant; Category: MOSFETs; Stock: 336146; Pricing: 1=0.52, 10=0.322, 50=0.2332, 100=0.2043, 500=0.15316 (USD); Case/Package: SOT-23; Continuous Drain Current (ID): 5.7A; Country of Origin: Mainland China; Drain to Source Breakdown Voltage: 30V; Drain to Source Voltage (Vdss): 30V; Export Control Classification Number (ECCN) Code: EAR99; Height: 1.25mm; Introduction Date: 2007-04-17; Lead Free: Lead Free; Lifecycle Status: Production; Max Operating Temperature: 150°C; Min Breakdown Voltage: 30V; Min Operating Temperature: -55°C; Mounting Technology: Surface Mount; Number of Elements: 1; Pins: 3; Number of Terminals: 3; Power Dissipation: 1.4W; Radiation Hardening: No; Rds On Max: 26.5mΩ; REACH SVHC: Unaffected; Schedule B: 8541290080, 8541290080|8541290080|8541290080|8541290080|8541290080; ComponentLink1URL: https://sigma.octopart.com:443/140150677/technical_drawing/Alpha-%26-Omega-Semiconductor-AO3400A.pdf?src-supplier=Alpha+%26+Omega+Semiconductor+SCT; ComponentLink1Description: https://sigma.octopart.com:443/140150677/technical_drawing/Alpha-%26-Omega-Semiconductor-AO3400A.pdf?src-supplier=Alpha+%26+Omega+Semiconductor+SCT; ComponentLink2URL: https://datasheet.octopart.com:443/AO3400A-Alpha-%26-Omega-Semiconductor-datasheet-11777925.pdf?src-supplier=IHS; ComponentLink2Description: https://datasheet.octopart.com:443/AO3400A-Alpha-%26-Omega-Semiconductor-datasheet-11777925.pdf?src-supplier=IHS; ComponentLink3URL: https://sigma.octopart.com:443/138895710/technical_drawing/Alpha-%26-Omega-Semiconductor-AO3400A.pdf?src-supplier=Upverter; ComponentLink3Description: https://sigma.octopart.com:443/138895710/technical_drawing/Alpha-%26-Omega-Semiconductor-AO3400A.pdf?src-supplier=Upverter; ComponentLink4URL: https://datasheet.octopart.com:443/AO3400A-Alpha-%26-Omega-Semiconductor-datasheet-14060799.pdf?src-supplier=iiiC; ComponentLink4Description: https://datasheet.octopart.com:443/AO3400A-Alpha-%26-Omega-Semiconductor-datasheet-14060799.pdf?src-supplier=iiiC; ComponentLink5URL: https://datasheet.octopart.com:443/AO3400A-Alpha-%26-Omega-Semiconductor-datasheet-5402508.pdf?src-supplier=Verical; ComponentLink5Description: https://datasheet.octopart.com:443/AO3400A-Alpha-%26-Omega-Semiconductor-datasheet-5402508.pdf?src-supplier=Verical; LCSC Part Number: C20917